# Altium project Schematic.PrjPcb
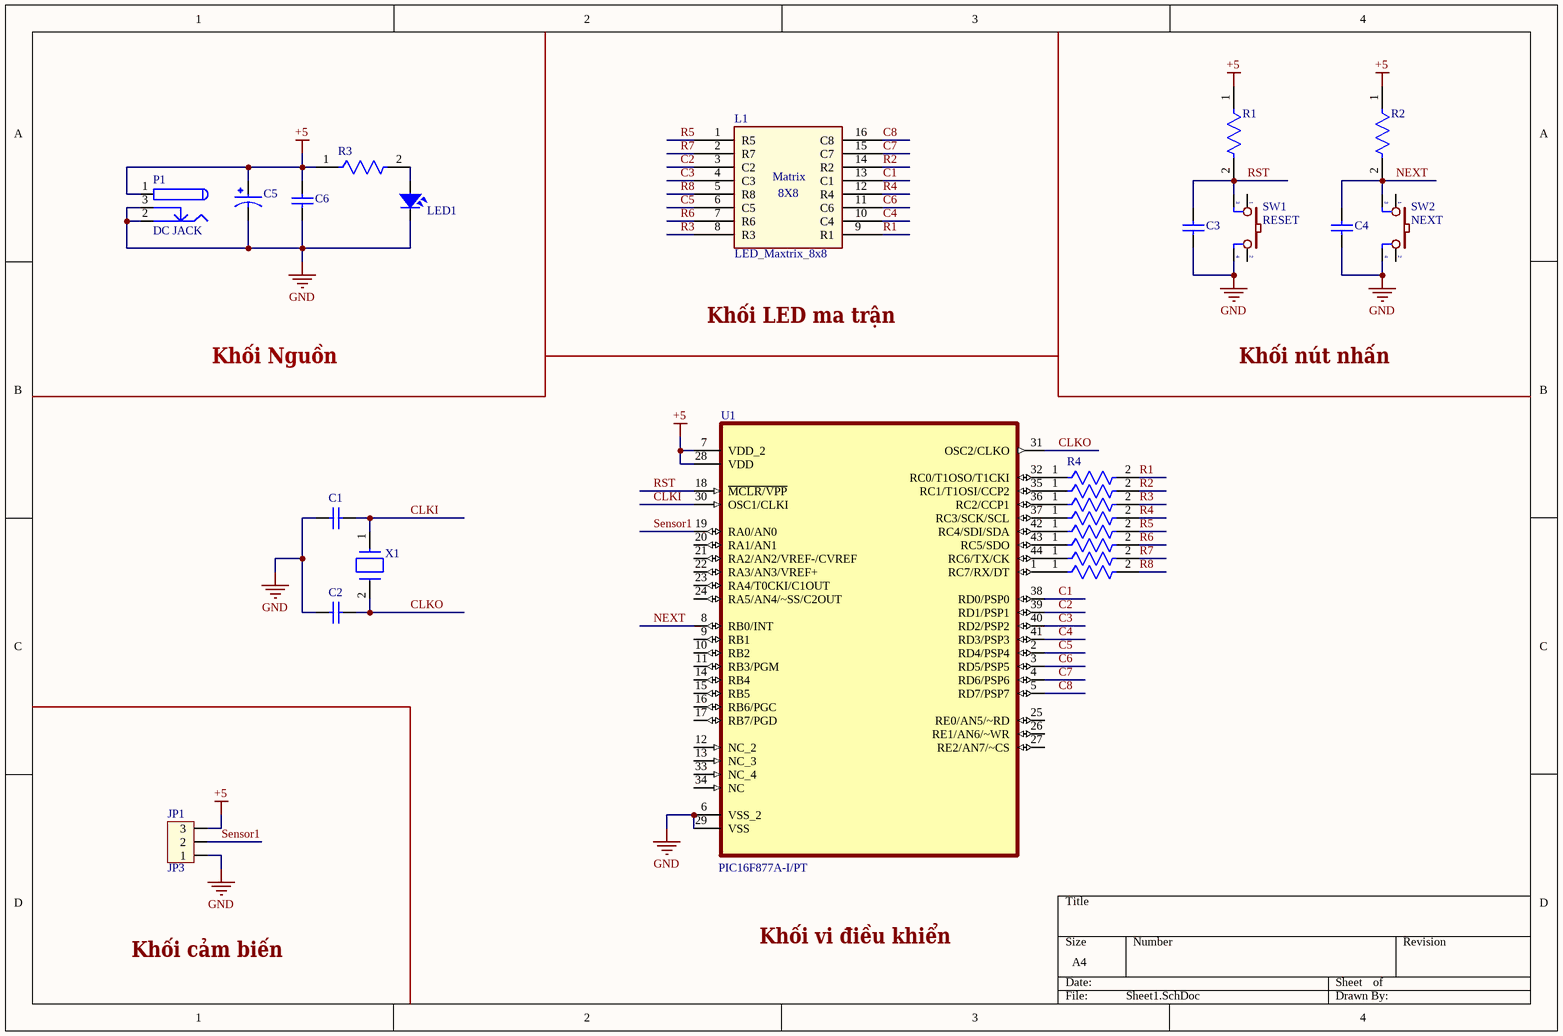
[diagram p0: Sheet1.SchDoc]
1 sheet, 25 parts. Net scope: global (net labels, ports and power ports of the same name join across sheets).
Board file: PCB1.PcbDoc

## Sheet Sheet1.SchDoc
size A4; SheetNumber: 1; SheetTotal: 1

### Parts
C1  22p  [CAPC2013X94X50LL25T25]  (value not drawn)
C2  22p  [CAPC2013X94X50LL25T25]  (value not drawn)
C3  0.1uF  [CAPC2013X94X50LL25T25]  (value not drawn)
C4  0.1uF  [CAPC2013X94X50LL25T25]  (value not drawn)
C5  EEE-FK1H101GP  [FP-FKF-MFG]  (value not drawn)
C6  0.1uF  [CAPC2013X94X50LL25T25]  (value not drawn)
JP1  JP3  [CON3]
L1  LED_Maxtrix_8x8  [LED_Matrix_8x8]
LED1  LED SMD  [SM-LED-0805-Green]  (value not drawn)
P1  DC JACK  [DC5.5/2.1]
R1  10k  [FP-CR0805-MFG]  (value not drawn)
R2  10k  [FP-CR0805-MFG]  (value not drawn)
R3  470R  [FP-CR0805-IPC_A]  (value not drawn)
R4  330R  [FP-CR0805-IPC_A]  (value not drawn)
R5  330R  [FP-CR0805-IPC_A]  (value not drawn)
R6  330R  [FP-CR0805-IPC_A]  (value not drawn)
R7  330R  [FP-CR0805-IPC_A]  (value not drawn)
R8  330R  [FP-CR0805-IPC_A]  (value not drawn)
R9  330R  [FP-CR0805-IPC_A]  (value not drawn)
R10  330R  [FP-CR0805-IPC_A]  (value not drawn)
R11  330R  [FP-CR0805-IPC_A]  (value not drawn)
SW1  RESET  [SW4]
SW2  NEXT  [SW4]
U1  PIC16F877A-I/PT  [TQFP-44]
X1  16MHz  [FP-ABM7-MFG]  (value not drawn)

### Nets
+5: C5.1 C6.2 JP1.3 P1.1 R1.1 R2.1 R3.1 U1.7(VDD_2) U1.28(VDD)
GND: C1.1 C2.1 C3.1 C4.1 C5.2 C6.1 JP1.1 LED1.2 P1.2 P1.3 SW1.4 SW2.4 U1.6(VSS_2) U1.29(VSS)
C1: L1.13(C1) U1.38(RD0/PSP0)
C2: L1.3(C2) U1.39(RD1/PSP1)
C3: L1.4(C3) U1.40(RD2/PSP2)
C4: L1.10(C4) U1.41(RD3/PSP3)
C5: L1.6(C5) U1.2(RD4/PSP4)
C6: L1.11(C6) U1.3(RD5/PSP5)
C7: L1.15(C7) U1.4(RD6/PSP6)
C8: L1.16(C8) U1.5(RD7/PSP7)
CLKI: C1.2 U1.30(OSC1/CLKI) X1.1
CLKO: C2.2 U1.31(OSC2/CLKO) X1.2
NEXT: C4.2 R2.2 SW2.3 U1.8(RB0/INT)
R1: L1.9(R1) R4.2
R2: L1.14(R2) R5.2
R3: L1.8(R3) R6.2
R4: L1.12(R4) R7.2
R5: L1.1(R5) R8.2
R6: L1.7(R6) R9.2
R7: L1.2(R7) R10.2
R8: L1.5(R8) R11.2
RST: C3.2 R1.2 SW1.3 U1.18(~{MCLR/VPP})
Sensor1: JP1.2 U1.19(RA0/AN0)
NetLED1_1: LED1.1 R3.2
NetR4_1: R4.1 U1.32(RC0/T1OSO/T1CKI)
NetR5_1: R5.1 U1.35(RC1/T1OSI/CCP2)
NetR6_1: R6.1 U1.36(RC2/CCP1)
NetR7_1: R7.1 U1.37(RC3/SCK/SCL)
NetR8_1: R8.1 U1.42(RC4/SDI/SDA)
NetR9_1: R9.1 U1.43(RC5/SDO)
NetR10_1: R10.1 U1.44(RC6/TX/CK)
NetR11_1: R11.1 U1.1(RC7/RX/DT)

Not connected (* = marked no-connect by the designer): SW1 1 2; SW2 1 2; U1 9(RB1) 10(RB2) 11(RB3/PGM) 12(NC_2) 13(NC_3) 14(RB4) 15(RB5) 16(RB6/PGC) 17(RB7/PGD) 20(RA1/AN1) 21(RA2/AN2/VREF-/CVREF) 22(RA3/AN3/VREF+) 23(RA4/T0CKI/C1OUT) 24(RA5/AN4/~SS/C2OUT) 25(RE0/AN5/~RD) 26(RE1/AN6/~WR) 27(RE2/AN7/~CS) 33(NC_4) 34(NC)

### Notes on the sheet
- Khối Nguồn
- Labels drawn without touching a wire or pin: Khối cảm biến, Khối LED ma trận, Khối nút nhấn, Khối vi điều khiển
- (in symbol LED_Maxtrix_8x8) Matrix; 8X8

### Library data of the parts
C1-C4 C6 = LD051C104KAB2A: Cap Ceramic 0.1uF 100V X7R 10% SMD 0805 125°C Embossed T/R; Manufacturer: Kyocera AVX; Value: 100nF; Supplier: Arrow Electronics; Supplier Part Number: LD051C104KAB2A; Manufacturer Part Number: LD051C104KAB2A; RoHS: No; Category: Ceramic Capacitors; Stock: 6000; Pricing: 2000=0,35070 (USD); Mounting Technology: Surface Mount; Case/Package: 0805; Pins: 2; Case Code (Metric): 2012; Case Code (Imperial): 0805; Dielectric Material: Ceramic; Weight: 0.000194oz; Min Operating Temperature: -55°C; Max Operating Temperature: 125°C; Voltage Rating: 100V; Tolerance: 10%; Packaging: Tape and Reel; Voltage Rating (DC): 100V; Dielectric: X7R; Package Quantity: 1; Termination: SMD/SMT; Series: LD; Length: 0.079inch; Width: 0.049inch; Height: 1.4mm; Thickness: 0.037inch; Depth: 1.25mm; RoHS Compliant: No; Lead Free: Contains Lead; ComponentLink1URL: https://datasheet.ciiva.com/16443/tinterm-16443613.pdf?src-supplier=Future+Electronics; ComponentLink1Description: https://datasheet.ciiva.com/16443/tinterm-16443613.pdf?src-supplier=Future+Electronics; ComponentLink2URL: https://datasheet.ciiva.com/6256/tinterm-6256703.pdf?src-supplier=Digi-Key; ComponentLink2Description: https://datasheet.ciiva.com/6256/tinterm-6256703.pdf?src-supplier=Digi-Key
C5 = EEE-FK1H101GP: Cap Aluminum 100uF 50V 20% (8 X 10.2mm) SMD 350mA 5000 hr 105°C T/R; Manufacturer: Panasonic; Life (Hours): 5000Hour; Leakage Current: 10mA; Impedance: 340mR; Supplier: Avnet; Supplier Part Number: EEE-FK1H101GP; Manufacturer Part Number: EEE-FK1H101GP; RoHS: Yes; Category: Aluminum Electrolytic Capacitors; Stock: 500; Pricing: 500=0,30333, 1000=0,29721, 2000=0,29302, 3000=0,28465, 4000=0,27837, 5000=0,27314, 50000=0,26790 (USD); Mounting Technology: Surface Mount,PCB; Case/Package: SMD/SMT; Pins: 2; Contact Plating: Tin; Min Operating Temperature: -55°C; Max Operating Temperature: 105°C; Value: 100uF; Tolerance: 20%; Voltage Rating (DC): 50V; Voltage Rating: 50V; Packaging: Tape and Reel; Ripple Current: 350mA; Package Quantity: 500; Termination: SMD/SMT; Series: FK; Construction: Cylindrical; Voltage: 50V; Ripple Current (AC): 350mA; ESR (Equivalent Series Resistance): 340mR; Diameter: 8mm; Length: 10.2mm; Width: 10mm; Height: 10.2mm; Height - Seated (Max): 0.402inch; Ratings: AEC-Q200; Radiation Hardening: No; RoHS Compliant: Yes; Lead Free: Lead Free; Reach SVHC Compliant: Yes; ComponentLink1URL: https://datasheet.ciiva.com/11783/0900766b80e4e8b0-11783656.pdf?src-supplier=Rs; ComponentLink1Description: https://datasheet.ciiva.com/11783/0900766b80e4e8b0-11783656.pdf?src-supplier=Rs; ComponentLink2URL: https://datasheet.ciiva.com/43458/1676921-43458443.pdf?src-supplier=Farnell; ComponentLink2Description: https://datasheet.ciiva.com/43458/1676921-43458443.pdf?src-supplier=Farnell; ComponentLink3URL: https://datasheet.ciiva.com/46388/1676921-46388584.pdf?src-supplier=Element14; ComponentLink3Description: https://datasheet.ciiva.com/46388/1676921-46388584.pdf?src-supplier=Element14; ComponentLink4URL: https://datasheet.ciiva.com/46376/1676921-46376474.pdf?src-supplier=Element14; ComponentLink4Description: https://datasheet.ciiva.com/46376/1676921-46376474.pdf?src-supplier=Element14; ComponentLink5URL: https://datasheet.ciiva.com/24028/aba0000ce120-24028319.pdf?src-supplier=Mouser; ComponentLink5Description: https://datasheet.ciiva.com/24028/aba0000ce120-24028319.pdf?src-supplier=Mouser; ComponentLink6URL: https://datasheet.ciiva.com/14603/70258115-14603038.pdf?src-supplier=Allied+Electronics; ComponentLink6Description: https://datasheet.ciiva.com/14603/70258115-14603038.pdf?src-supplier=Allied+Electronics; ComponentLink7URL: https://datasheet.ciiva.com/11679/aba0000ce120-11679941.pdf?src-supplier=Avnet; ComponentLink7Description: https://datasheet.ciiva.com/11679/aba0000ce120-11679941.pdf?src-supplier=Avnet; ComponentLink8URL: https://datasheet.ciiva.com/16432/aba0000ce120-16432910.pdf?src-supplier=Future+Electronics; ComponentLink8Description: https://datasheet.ciiva.com/16432/aba0000ce120-16432910.pdf?src-supplier=Future+Electronics; ComponentLink9URL: https://datasheet.ciiva.com/30067/aba0000ce120-30067319.pdf?src-supplier=Onlinecomponents.com; ComponentLink9Description: https://datasheet.ciiva.com/30067/aba0000ce120-30067319.pdf?src-supplier=Onlinecomponents.com
JP1 = Con3: Connector 3; Value: Connector 3
LED1 = LED-SMD-0805
P1 = DC5.5/2.1: Low Voltage Power Supply Connector; Solder: WAVE
R1-R3 = CR0805-JW-331ELF: Res Thick Film 0805 330 Ohm 5% 1/8W ±200ppm/°C Molded SMD SMD Paper Tape on Plastic Reel; Manufacturer: Bourns; Value: 330R; Power Rating: 125mW; Voltage Rating: 150V; Supplier: Arrow Electronics; Supplier Part Number: CR0805-JW-331ELF; Manufacturer Part Number: CR0805-JW-331ELF; RoHS: Yes; Category: Chip SMD Resistors; Stock: 10000; Pricing: 5000=0,00270, 10000=0,00240, 25000=0,00210, 50000=0,00210 (USD); Mounting Technology: Surface Mount; Case/Package: 0805; Pins: 2; Case Code (Metric): 2012; Case Code (Imperial): 0805; Contact Plating: Tin; Min Operating Temperature: -55°C; Max Operating Temperature: 155°C; Tolerance: 5%; Packaging: Tape and Reel; Package Quantity: 1; Resistor Type: Thick Film; Number of Terminations: 2; Termination: SMD/SMT; Temperature Coefficient: 200ppm/°C; Max Power Dissipation: 125mW; Series: CR0805; Voltage Rating (DC): 150V; Features: Moisture Resistant; Resistance Tolerance: 5%; Construction: Rectangular; Length: 2mm; Width: 1.25mm; Height: 0.024inch; Depth: 1.25mm; Thickness: 508um; Radiation Hardening: No; RoHS Compliant: Yes; Reach SVHC Compliant: Yes; Military Standard: Not; ComponentLink1URL: https://datasheet.ciiva.com/22713/691949-22713270.pdf?src-supplier=Element14; ComponentLink1Description: https://datasheet.ciiva.com/22713/691949-22713270.pdf?src-supplier=Element14; ComponentLink2URL: https://datasheet.ciiva.com/9119/chpreztr-9119959.pdf?src-supplier=Avnet; ComponentLink2Description: https://datasheet.ciiva.com/9119/chpreztr-9119959.pdf?src-supplier=Avnet; ComponentLink3URL: https://datasheet.ciiva.com/46383/1791942-46383770.pdf?src-supplier=Element14; ComponentLink3Description: https://datasheet.ciiva.com/46383/1791942-46383770.pdf?src-supplier=Element14; ComponentLink4URL: https://datasheet.ciiva.com/6547/chpreztr-6547356.pdf?src-supplier=Digi-Key; ComponentLink4Description: https://datasheet.ciiva.com/6547/chpreztr-6547356.pdf?src-supplier=Digi-Key; ComponentLink5URL: https://datasheet.ciiva.com/6547/chpreztr-6547357.pdf?src-supplier=Digi-Key; ComponentLink5Description: https://datasheet.ciiva.com/6547/chpreztr-6547357.pdf?src-supplier=Digi-Key; ComponentLink6URL: https://datasheet.ciiva.com/6547/chpreztr-6547358.pdf?src-supplier=Digi-Key; ComponentLink6Description: https://datasheet.ciiva.com/6547/chpreztr-6547358.pdf?src-supplier=Digi-Key; ComponentLink7URL: https://datasheet.ciiva.com/7986/1902866-7986190.pdf?src-supplier=Element14; ComponentLink7Description: https://datasheet.ciiva.com/7986/1902866-7986190.pdf?src-supplier=Element14
R4-R11 = CR0805-JW-331ELF: Res Thick Film 0805 330 Ohm 5% 1/8W ±200ppm/°C Molded SMD SMD Paper Tape on Plastic Reel; Manufacturer: Bourns; Power Rating: 125mW; Voltage Rating: 150V; Supplier: Arrow Electronics; Supplier Part Number: CR0805-JW-331ELF; Manufacturer Part Number: CR0805-JW-331ELF; RoHS: Yes; Category: Chip SMD Resistors; Stock: 10000; Pricing: 5000=0,00270, 10000=0,00240, 25000=0,00210, 50000=0,00210 (USD); Mounting Technology: Surface Mount; Case/Package: 0805; Pins: 2; Case Code (Metric): 2012; Case Code (Imperial): 0805; Contact Plating: Tin; Min Operating Temperature: -55°C; Max Operating Temperature: 155°C; Value: 330R; Tolerance: 5%; Packaging: Tape and Reel; Package Quantity: 1; Resistor Type: Thick Film; Number of Terminations: 2; Termination: SMD/SMT; Temperature Coefficient: 200ppm/°C; Max Power Dissipation: 125mW; Series: CR0805; Voltage Rating (DC): 150V; Features: Moisture Resistant; Resistance Tolerance: 5%; Construction: Rectangular; Length: 2mm; Width: 1.25mm; Height: 0.024inch; Depth: 1.25mm; Thickness: 508um; Radiation Hardening: No; RoHS Compliant: Yes; Reach SVHC Compliant: Yes; Military Standard: Not; ComponentLink1URL: https://datasheet.ciiva.com/22713/691949-22713270.pdf?src-supplier=Element14; ComponentLink1Description: https://datasheet.ciiva.com/22713/691949-22713270.pdf?src-supplier=Element14; ComponentLink2URL: https://datasheet.ciiva.com/9119/chpreztr-9119959.pdf?src-supplier=Avnet; ComponentLink2Description: https://datasheet.ciiva.com/9119/chpreztr-9119959.pdf?src-supplier=Avnet; ComponentLink3URL: https://datasheet.ciiva.com/46383/1791942-46383770.pdf?src-supplier=Element14; ComponentLink3Description: https://datasheet.ciiva.com/46383/1791942-46383770.pdf?src-supplier=Element14; ComponentLink4URL: https://datasheet.ciiva.com/6547/chpreztr-6547356.pdf?src-supplier=Digi-Key; ComponentLink4Description: https://datasheet.ciiva.com/6547/chpreztr-6547356.pdf?src-supplier=Digi-Key; ComponentLink5URL: https://datasheet.ciiva.com/6547/chpreztr-6547357.pdf?src-supplier=Digi-Key; ComponentLink5Description: https://datasheet.ciiva.com/6547/chpreztr-6547357.pdf?src-supplier=Digi-Key; ComponentLink6URL: https://datasheet.ciiva.com/6547/chpreztr-6547358.pdf?src-supplier=Digi-Key; ComponentLink6Description: https://datasheet.ciiva.com/6547/chpreztr-6547358.pdf?src-supplier=Digi-Key; ComponentLink7URL: https://datasheet.ciiva.com/7986/1902866-7986190.pdf?src-supplier=Element14; ComponentLink7Description: https://datasheet.ciiva.com/7986/1902866-7986190.pdf?src-supplier=Element14
SW1 SW2 = SW4-1: Switch button 4 pin; Value: SW chip 4 pin
U1 = PIC16F877A-I/PT: PIC16F877A Microcontroller IC 8-Bit 20MHz 14KB _8K x 14_ FLASH 44-TQFP _10x10_; MF: Microchip; Price: None; Package: TQFP-44 Microchip; MP: PIC16F877A-I/PT; Value: *; Availability: Unavailable; SnapEDA_Link: https://www.snapeda.com/parts/PIC16F877A-I/PT/Microchip/view-part/39699/?ref=snap
X1 = ABM7-16.000MHZ-4-T: Crystal 16MHz ±30ppm (Tol) ±50ppm (Stability) 18pF FUND 50Ohm 2-Pin Mini-CSMD T/R; Manufacturer: Abracon; ESR (Equivalent Series Resistance): 50R; Supplier: Mouser; Supplier Part Number: 815-ABM716.MHZ4T; Manufacturer Part Number: ABM7-16.000MHZ-4-T; RoHS: Yes; Category: Crystals; Stock: 701; Pricing: 1=0,87000, 10=0,87000, 50=0,87000, 100=0,87000, 1000=0,53000, 10000=0,53000 (USD); Mounting Technology: Surface Mount; Case/Package: SMD/SMT; Min Operating Temperature: -10°C; Max Operating Temperature: 60°C; Frequency Tolerance: 30ppm; Load Capacitance: 18pF; Frequency: 16MHz; Packaging: Tape and Reel; Frequency Stability: 50ppm; Length: 0.236inch; Width: 0.138inch; Height: 0.055inch; RoHS Compliant: Yes; Lead Free: Lead Free; Reach SVHC Compliant: Yes; ComponentLink1URL: https://datasheet.ciiva.com/16411/abm7-16411039.pdf?src-supplier=Future+Electronics; ComponentLink1Description: https://datasheet.ciiva.com/16411/abm7-16411039.pdf?src-supplier=Future+Electronics